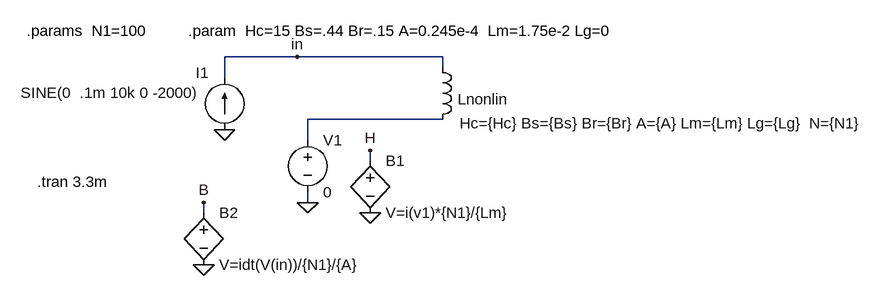
[diagram p0: schematic BH_CURVE.asc]
BH_CURVE.asc, the LTspice schematic file:
Version 4
SHEET 1 884 680
WIRE -544 32 -656 32
WIRE -320 32 -544 32
WIRE -320 48 -320 32
WIRE -656 64 -656 32
WIRE -320 128 -528 128
WIRE -528 160 -528 128
WIRE -432 192 -432 176
WIRE -528 256 -528 240
WIRE -688 272 -688 256
FLAG -528 256 0
FLAG -656 144 0
FLAG -432 272 0
FLAG -432 176 H
FLAG -544 32 in
FLAG -688 352 0
FLAG -688 256 B
SYMBOL ind -336 32 R0
WINDOW 3 42 102 Left 2
WINDOW 0 39 65 Left 2
SYMATTR Value Hc={Hc} Bs={Bs} Br={Br} A={A} Lm={Lm} Lg={Lg}  N={N1}
SYMATTR InstName Lnonlin
SYMBOL current -656 144 R180
WINDOW 0 24 88 Left 2
WINDOW 3 39 57 Left 2
WINDOW 123 0 0 Left 2
WINDOW 39 0 0 Left 2
SYMATTR InstName I1
SYMATTR Value SINE(0  .1m 10k 0 -2000)
SYMBOL voltage -528 144 R0
WINDOW 123 0 0 Left 2
WINDOW 39 0 0 Left 2
SYMATTR InstName V1
SYMATTR Value 0
SYMBOL bv -432 176 R0
SYMATTR InstName B1
SYMATTR Value V=i(v1)*{N1}/{Lm}
SYMBOL bv -688 256 R0
SYMATTR InstName B2
SYMATTR Value V=idt(V(in))/{N1}/{A}
TEXT -960 -8 Left 2 !.params  N1=100
TEXT -944 224 Left 2 !.tran 3.3m
TEXT -712 -8 Left 2 !.param  Hc=15 Bs=.44 Br=.15 A=0.245e-4  Lm=1.75e-2 Lg=0

The netlist it stands for:
* BH_CURVE.asc
Lnonlin in N001 Hc={Hc} Bs={Bs} Br={Br} A={A} Lm={Lm} Lg={Lg}  N={N1}
I1 0 in SINE(0  .1m 10k 0 -2000)
V1 N001 0 0
B1 H 0 V=i(v1)*{N1}/{Lm}
B2 B 0 V=idt(V(in))/{N1}/{A}
.params  N1=100
.tran 3.3m
.param  Hc=15 Bs=.44 Br=.15 A=0.245e-4  Lm=1.75e-2 Lg=0
.backanno
.end